# Altium schematic sheet PATHOS_FPGA.SchDoc: FPGA Overview
size A4; Author: A. Kalberer; CompanyName: NTB; Organization: NTB Interstate University of Applied; Address1: Werdenbergstrasse 4; Address3: 9471 Buchs; Address4: Switzerland; Revision: 0.1; Organization1: Sciences of Technology Buchs; Size: A4
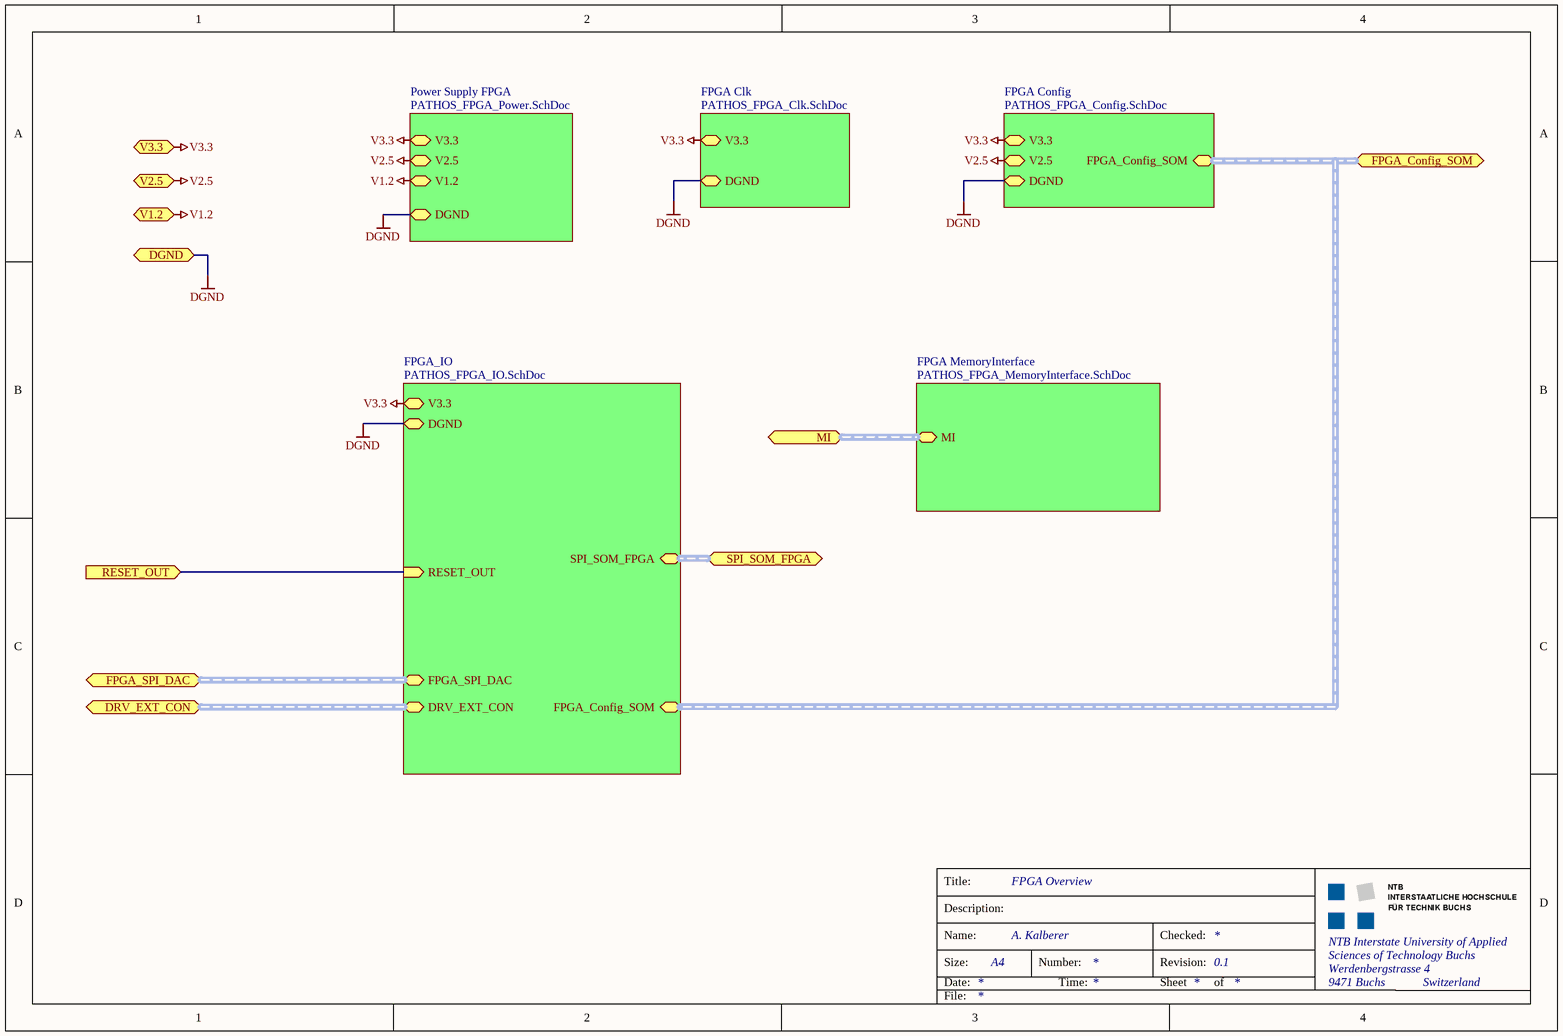
[diagram p0: PATHOS_FPGA.SchDoc]

## Sub-sheets
FPGA Clk = PATHOS_FPGA_Clk.SchDoc: V3.3, DGND
FPGA Config = PATHOS_FPGA_Config.SchDoc: V3.3, DGND, V2.5, FPGA_Config_SOM (harness FPGA_Config_SOM)
FPGA MemoryInterface = PATHOS_FPGA_MemoryInterface.SchDoc: MI (harness MI)
FPGA_IO = PATHOS_FPGA_IO.SchDoc: RESET_OUT (in), SPI_SOM_FPGA (harness SPI_SOM_FPGA), FPGA_Config_SOM (harness FPGA_Config_SOM), FPGA_SPI_DAC (harness FPGA_SPI_DAC), V3.3, DGND, DRV_EXT_CON (harness DRV_EXT_CON)
Power Supply FPGA = PATHOS_FPGA_Power.SchDoc: V3.3, V2.5, V1.2, DGND

## Ports
DGND, DRV_EXT_CON (harness DRV_EXT_CON), FPGA_Config_SOM (harness FPGA_Config_SOM), FPGA_SPI_DAC (harness FPGA_SPI_DAC), MI (harness MI), RESET_OUT (in), SPI_SOM_FPGA (harness SPI_SOM_FPGA), V1.2, V2.5, V3.3

## Nets
DGND: port DGND, sheet Power Supply FPGA/DGND, sheet FPGA Clk/DGND, sheet FPGA_IO/DGND, sheet FPGA Config/DGND
V1.2: port V1.2, sheet Power Supply FPGA/V1.2
V2.5: port V2.5, sheet Power Supply FPGA/V2.5, sheet FPGA Config/V2.5
V3.3: port V3.3, sheet Power Supply FPGA/V3.3, sheet FPGA Clk/V3.3, sheet FPGA_IO/V3.3, sheet FPGA Config/V3.3
RESET_OUT: port RESET_OUT, sheet FPGA_IO/RESET_OUT

## Buses and harness runs
harness port DRV_EXT_CON = sheet FPGA_IO/DRV_EXT_CON
harness port FPGA_Config_SOM = sheet FPGA Config/FPGA_Config_SOM = sheet FPGA_IO/FPGA_Config_SOM
harness port FPGA_SPI_DAC = sheet FPGA_IO/FPGA_SPI_DAC
harness port MI = sheet FPGA MemoryInterface/MI
harness port SPI_SOM_FPGA = sheet FPGA_IO/SPI_SOM_FPGA

## Notes on the sheet
- Title:
- Description:
- Size:
- Date:
- Name:
- Number:
- Time:
- Revision:
- Sheet
- Checked:
- of
- File: